# Altium schematic sheet Battery_Charger.SchDoc: Battery Charger
size A4; SheetNumber: 2; SheetTotal: 10
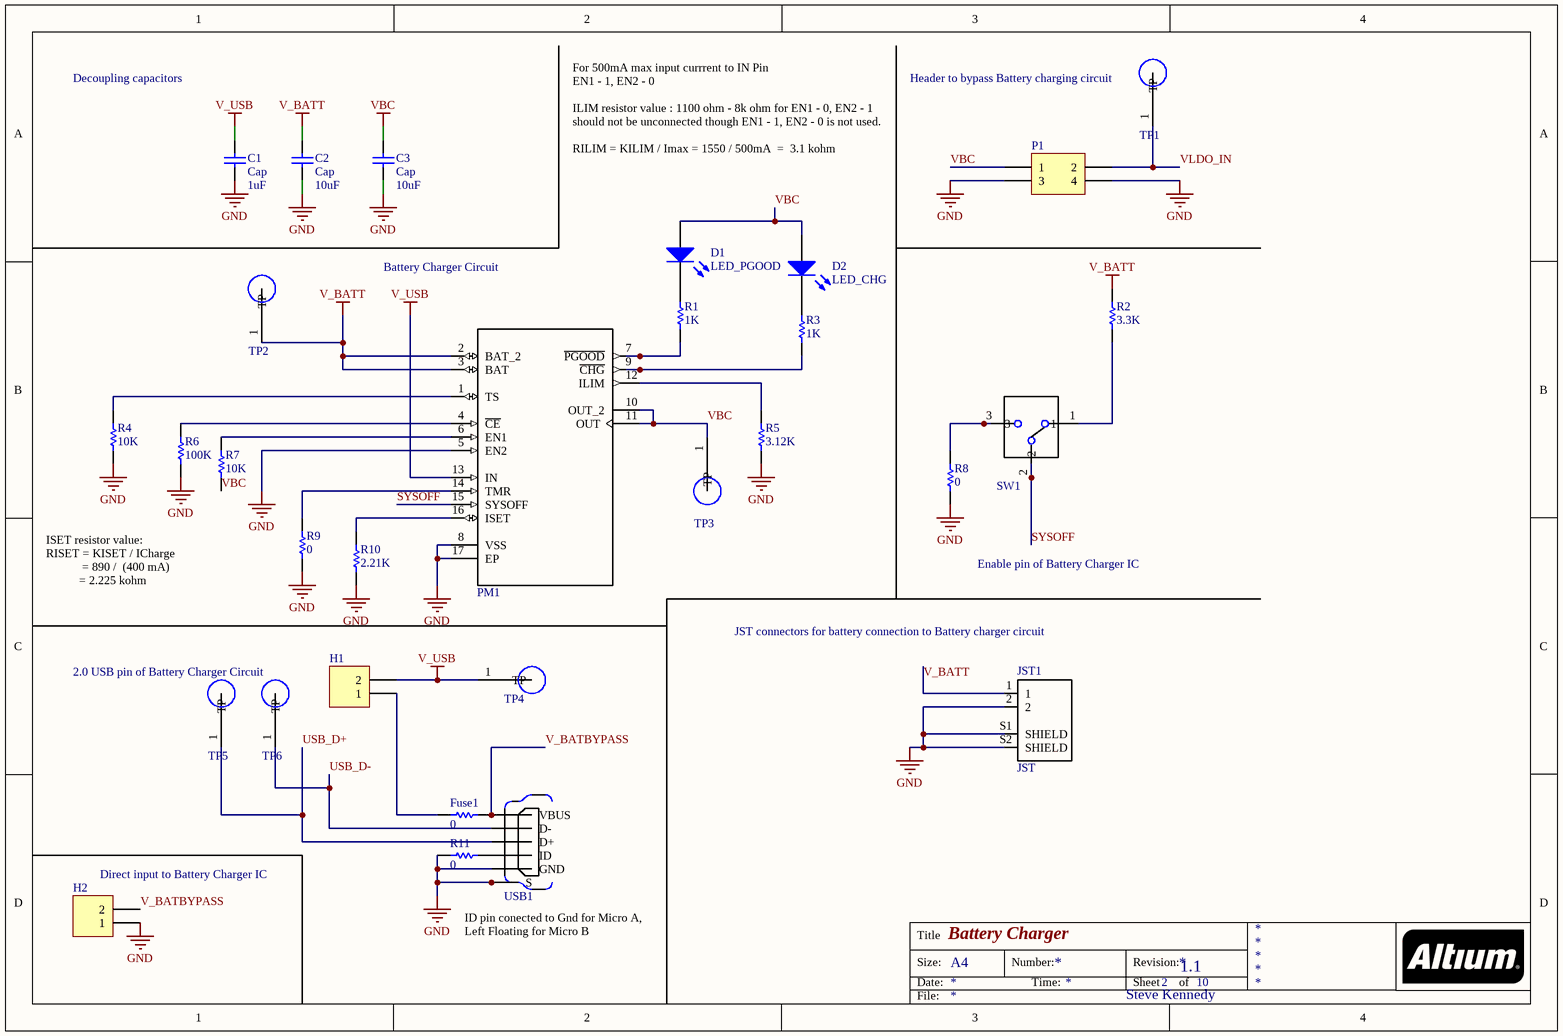
[diagram p0: Battery_Charger.SchDoc]

## Parts
C1  Cap  value 1uF  [1608[0603]]
C2  Cap  value 10uF  [1608[0603]]
C3  Cap  value 10uF  [1608[0603]]
D1  LED_PGOOD  [1608[0603]]
D2  LED_CHG  [1608[0603]]
Fuse1  value 0  [1608[0603]]  (hidden comment: fuse)
H1  Header 2  [HDR1X2]  (value not drawn)
H2  Header 2  [HDR1X2]  (value not drawn)
JST1  JST  [JST]
P1  Header 2X2H  [HDR2X2H]  (value not drawn)
PM1  POWER_IC  [Power_management]  (value not drawn)
R1  value 1K  [1608[0603]]  (hidden comment: Res1)
R2  value 3.3K  [1608[0603]]  (hidden comment: Res1)
R3  value 1K  [1608[0603]]  (hidden comment: Res1)
R4  value 10K  [1608[0603]]  (hidden comment: Res1)
R5  value 3.12K  [1608[0603]]  (hidden comment: Res1)
R6  value 100K  [1608[0603]]  (hidden comment: Res1)
R7  value 10K  [1608[0603]]  (hidden comment: Res1)
R8  value 0  [1608[0603]]  (hidden comment: Res1)
R9  value 0  [1608[0603]]  (hidden comment: Res1)
R10  value 2.21K  [1608[0603]]  (hidden comment: Res1)
R11  value 0  [1608[0603]]  (hidden comment: Res1)
SW1  SW  [SW]  (value not drawn)
TP1  TP  [TP]  (value not drawn)
TP2  TP  [TP]  (value not drawn)
TP3  TP  [TP]  (value not drawn)
TP4  TP  [TP]  (value not drawn)
TP5  TP  [TP]  (value not drawn)
TP6  TP  [TP]  (value not drawn)
USB1  USB  [USB]  (value not drawn)

## Nets
GND: C1.1 C2.1 C3.1 H2.1 JST1.2 JST1.S1(SHIELD) JST1.S2(SHIELD) P1.3 P1.4 PM1.5(EN2) PM1.8(VSS) PM1.17(EP) R4.1 R5.1 R6.1 R8.1 R9.1 R10.1 R11.2 USB1.5(GND) USB1.6(S) USB1.7(S) USB1.8(S) USB1.9(S)
V_BATT: C2.2 JST1.1 PM1.2(BAT_2) PM1.3(BAT) R2.2 TP2.1(TP)
V_USB: C1.2 H1.2 PM1.13(IN) TP4.1(TP)
VBC: C3.2 D1.1(A) D2.1(A) P1.1 PM1.10(OUT_2) PM1.11(OUT) R7.1 TP3.1(TP)
SYSOFF: PM1.15(SYSOFF) SW1.2
USB_D+: TP5.1(TP) USB1.3(D+)
USB_D-: TP6.1(TP) USB1.2(D-)
V_BATBYPASS: Fuse1.1 H2.2 USB1.1(VBUS)
VLDO_IN: P1.2 TP1.1(TP)
NetD1_2: D1.2(K) R1.2
NetD2_2: D2.2(K) R3.2
NetFuse1_2: Fuse1.2 H1.1
NetPM1_1: PM1.1(TS) R4.2
NetPM1_4: PM1.4(~{CE}) R6.2
NetPM1_6: PM1.6(EN1) R7.2
NetPM1_7: PM1.7(~{PGOOD}) R1.1
NetPM1_9: PM1.9(~{CHG}) R3.1
NetPM1_12: PM1.12(ILIM) R5.2
NetPM1_14: PM1.14(TMR) R9.2
NetPM1_16: PM1.16(ISET) R10.2
NetR2_1: R2.1 SW1.1
NetR8_2: R8.2 SW1.3
NetR11_1: R11.1 USB1.4(ID)

## Notes on the sheet
- Decoupling capacitors
- (near TP1) Header to bypass Battery charging circuit
- For 500mA max input currrent to IN Pin
  EN1 - 1, EN2 - 0
  ILIM resistor value : 1100 ohm - 8k ohm for EN1 - 0, EN2 - 1
  should not be unconnected though EN1 - 1, EN2 - 0 is not used.
  RILIM = KILIM / Imax = 1550 / 500mA  =  3.1 kohm
- Battery Charger Circuit
- Enable pin of Battery Charger IC
- ISET resistor value:
  RISET = KISET / ICharge
  = 890 /  (400 mA)
  = 2.225 kohm
- JST connectors for battery connection to Battery charger circuit
- 2.0 USB pin of Battery Charger Circuit
- (near H2) Direct input to Battery Charger IC
- (near USB1) ID pin conected to Gnd for Micro A,
  Left Floating for Micro B
- 1.1
- Steve Kennedy
- Title
- Size:
- Date:
- A4
- Number:
- Time:
- Revision:
- Sheet
- of
- File:

## Library data of the parts
C1-C3 = Cap: 10000pF ±10% 50V Ceramic Capacitor X7R 0603 (1608 Metric); Manufacturer: Samsung Electro-Mechanics; Manufacturer Part Number: CL10B103KB8NNNC; Digi-Key Part Number: 1276-1009-1-ND; DigiKeyURL: https://www.digikey.com/product-detail/en/samsung-electro-mechanics/CL10B103KB8NNNC/1276-1009-1-ND/3889095
D1 = LED2: LED GREEN DIFFUSED 0603 SMD; Manufacturer: OSRAM Opto Semiconductors Inc.; Manufacturer Part Number: LG L29K-F2J1-24-Z; Digi-Key Part Number: 475-3118-1-ND; DigiKeyURL: https://www.digikey.com/product-detail/en/osram-opto-semiconductors-inc/LG-L29K-F2J1-24-Z/475-3118-1-ND/4899549
D2 = LED2: Blue 470nm LED Indication - Discrete 2.85V 0603 (1608 Metric); Manufacturer: OSRAM Opto Semiconductors Inc.; Manufacturer Part Number: LB Q39G-L2OO-35-1; Digi-Key Part Number: 475-2816-1-ND; DigiKeyURL: https://www.digikey.com/product-detail/en/osram-opto-semiconductors-inc/LB-Q39G-L2OO-35-1/475-2816-1-ND/2176355
Fuse1 R1-R4 R6 R7 = Res1: 10 kOhms ±1% 0.125W, 1/8W Chip Resistor 0603 (1608 Metric) Anti-Sulfur, Moisture Resistant Thin Film; Manufacturer: Stackpole Electronics Inc; Manufacturer Part Number: RNCP0603FTD10K0; Digi-Key Part Number: RNCP0603FTD10K0CT-ND; digi key link url: https://www.digikey.com/product-detail/en/stackpole-electronics-inc/RNCP0603FTD10K0/RNCP0603FTD10K0CT-ND/2240478
H1 H2 = Header 2: CONN HEADER VERT 8POS 2.54MM; Manufacturer: TE Connectivity AMP Connectors; Manufacturer Part Number: 5-146256-4; DigiKeyURL: https://www.digikey.com/product-detail/en/te-connectivity/5-146256-4/A121467-ND/2275818; Digi-Key Part Number: A121467-ND
JST1 = JST: SWITCH SLIDE SPDT 200MA 12V; Manufacturer: Nidec Copal Electronics; Manufacturer Part Number: CL-SB-12B-01T; Digi-Key Part Number: 563-1318-1-ND; Snapeda_Url: https://www.snapeda.com/parts/CL-SB-12B-01T/Nidec%20Copal/view-part/?ref=search&t=CL-SB-12B-01T; DigiKeyURL: https://www.digikey.com/product-detail/en/nidec-copal-electronics/CL-SB-12B-01T/563-1318-1-ND/3507878
P1 = Header 2X2H: CONN HEADER VERT 8POS 2.54MM; Manufacturer: TE Connectivity AMP Connectors; Manufacturer Part Number: 5-146256-4; Digi-Key Part Number: A121467-ND; DigiKeyURL: https://www.digikey.com/product-detail/en/te-connectivity/5-146256-4/A121467-ND/2275818
PM1 = POWER_IC: IC LI-ION CHARGE MGMT 16-QFN; Manufacturer: Texas Instruments; Manufacturer Part Number: BQ24075RGTR; Snapeda_Url: https://www.snapeda.com/parts/BQ24075RGTT/Texas%20Instruments/view-part/?ref=snap; Digi-Key Part Number: 296-38874-1-ND; DigiKeyURL: https://www.digikey.com/products/en?keywords=296-38874-1-ND
R5 = Res1: 10 kOhms ±1% 0.125W, 1/8W Chip Resistor 0603 (1608 Metric) Anti-Sulfur, Moisture Resistant Thin Film; Manufacturer: Yageo; Manufacturer Part Number: RT0603DRE073K12L; Digi-Key Part Number: 311-2562-1-ND; digi key link url: https://www.digikey.com/product-detail/en/yageo/RT0603DRE073K12L/311-2562-1-ND/6128981
R8 R9 R11 = Res1: RES SMD 0 OHM JUMPER 1/10W 0603; Manufacturer: Yageo; Manufacturer Part Number: RC0603JR-070RL; Digi-Key Part Number: 311-0.0GRCT-ND; digi key link url: https://www.digikey.com/product-detail/en/yageo/RC0603JR-070RL/311-0.0GRCT-ND/729622
R10 = Res1: 10 kOhms ±1% 0.125W, 1/8W Chip Resistor 0603 (1608 Metric) Anti-Sulfur, Moisture Resistant Thin Film; Manufacturer: Panasonic Electronic Components; Manufacturer Part Number: ERJ-3EKF2211V; Digi-Key Part Number: P2.21KHCT-ND; digi key link url: https://www.digikey.com/product-detail/en/panasonic-electronic-components/ERJ-3EKF2211V/P2.21KHCT-ND/198223
SW1 = SW: SWITCH SLIDE SPDT 200MA 12V; Manufacturer: Nidec Copal Electronics; Manufacturer Part Number: CL-SB-12B-01T; Snapeda_Url: https://www.snapeda.com/parts/CL-SB-12B-01T/Nidec%20Copal/view-part/?ref=search&t=CL-SB-12B-01T; DigiKeyURL: https://www.digikey.com/product-detail/en/nidec-copal-electronics/CL-SB-12B-01T/563-1318-1-ND/3507878; Digi-Key Part Number: 563-1318-1-ND
TP1-TP6 = TP: PC TEST POINT MINIATURE; Manufacturer: Keystone Electronics; Manufacturer Part Number: 5019; Snapeda_Url: https://www.snapeda.com/parts/5019/Keystone%20Electronics/view-part/?ref=search&t=5019; DigiKeyURL: https://www.digikey.com/product-detail/en/keystone-electronics/5019/36-5019CT-ND/3907344?utm_source=snapeda&utm_medium=aggregator&utm_campaign=symbol; Digi-Key Part Number: 36-5019CT-ND
USB1 = USB: CONN RCPT USB2.0 MICRO AB SMD RA; Manufacturer: Amphenol ICC (FCI); Manufacturer Part Number: 10104111-0001LF; Snapedu_Url: https://www.snapeda.com/parts/10104111-0001LF/Amphenol%20ICC/view-part/?ref=snap; DigiKeyURL: https://www.digikey.com/product-detail/en/amphenol-fci/10104111-0001LF/609-4053-1-ND/2350359?utm_source=snapeda&utm_medium=aggregator&utm_campaign=symbol; Digi-Key Part Number: 609-4053-1-ND